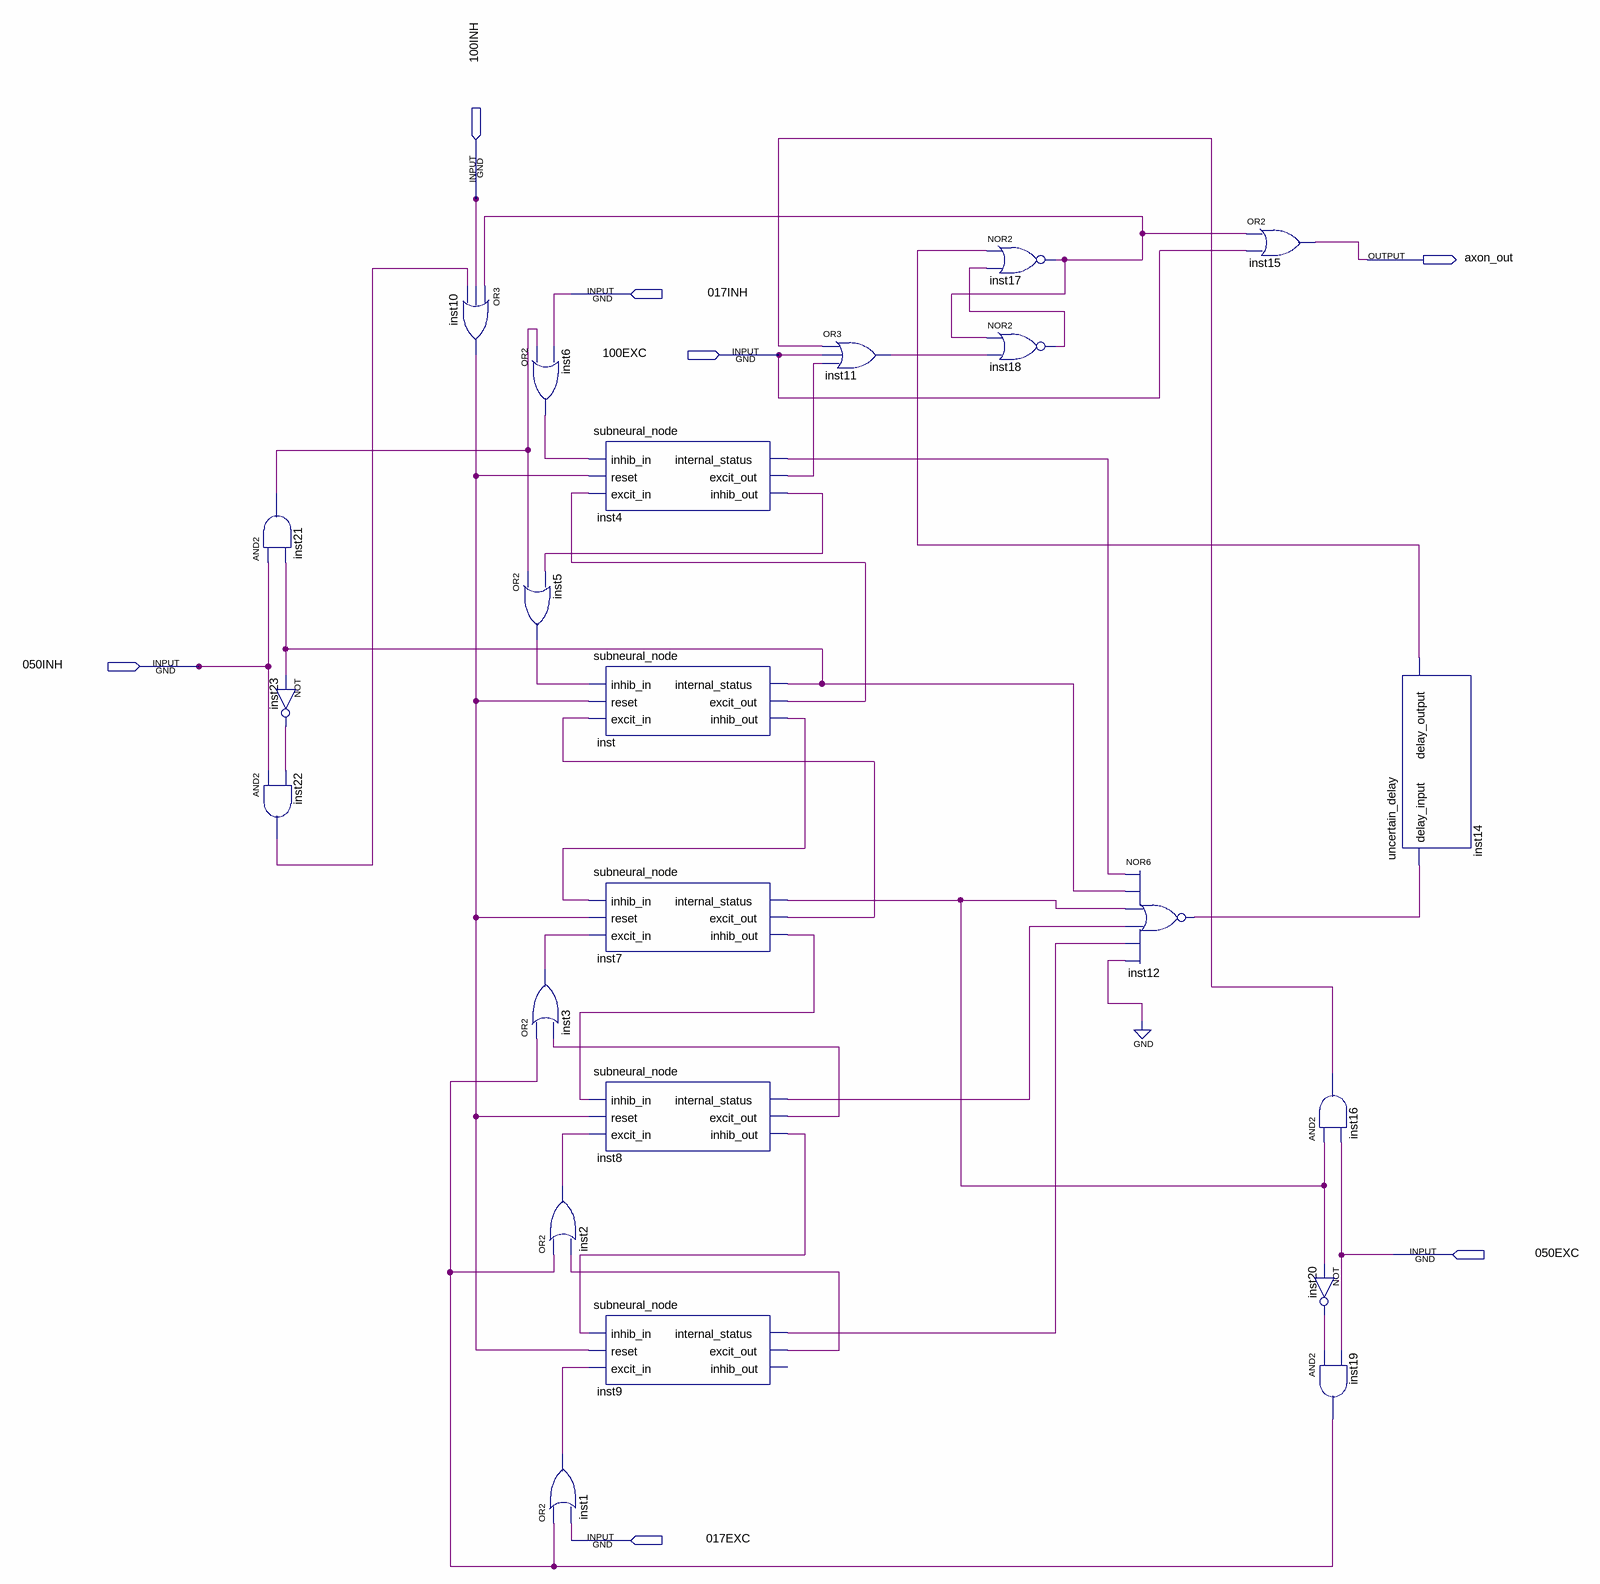
[diagram p0: schematic sheet]
// Quartus schematic soma_control_bloc.bdf as structural Verilog: 23 symbols, 7 pins
module soma_control_bloc (
  input  \100INH ,
  input  \017INH ,
  input  \100EXC ,
  input  \050INH ,
  input  \050EXC ,
  input  \017EXC ,
  output axon_out
);

  wire inst1_out, inst2_out, inst3_out, inst4_excit_out, inst4_inhib_out, inst4_internal_status, inst5_out,
       inst6_out, inst7_excit_out, inst7_inhib_out, inst7_internal_status, inst8_excit_out, inst8_inhib_out,
       inst8_internal_status, inst9_excit_out, inst9_internal_status, inst10_out, inst11_out, inst12_out,
       inst14_delay_output, inst16_out, inst17_out, inst18_out, inst19_out, inst20_out, inst21_out,
       inst22_out, inst23_out, inst_excit_out, inst_inhib_out, inst_internal_status;

  and inst21 (inst21_out, \050INH , inst_internal_status);
  and inst22 (inst22_out, \050INH , inst23_out);
  not inst23 (inst23_out, inst_internal_status);
  or inst10 (inst10_out, inst17_out, \100INH , inst22_out);
  or inst6 (inst6_out, inst21_out, \017INH );
  or inst5 (inst5_out, inst21_out, inst4_inhib_out);
  or inst3 (inst3_out, inst19_out, inst8_excit_out);
  subneural_node inst4 (
    .inhib_in(inst6_out), .reset(inst10_out), .excit_in(inst_excit_out),
    .internal_status(inst4_internal_status), .excit_out(inst4_excit_out), .inhib_out(inst4_inhib_out));
  subneural_node inst (
    .inhib_in(inst5_out), .reset(inst10_out), .excit_in(inst7_excit_out),
    .internal_status(inst_internal_status), .excit_out(inst_excit_out), .inhib_out(inst_inhib_out));
  subneural_node inst7 (
    .inhib_in(inst_inhib_out), .reset(inst10_out), .excit_in(inst3_out),
    .internal_status(inst7_internal_status), .excit_out(inst7_excit_out), .inhib_out(inst7_inhib_out));
  subneural_node inst8 (
    .inhib_in(inst7_inhib_out), .reset(inst10_out), .excit_in(inst2_out),
    .internal_status(inst8_internal_status), .excit_out(inst8_excit_out), .inhib_out(inst8_inhib_out));
  or inst2 (inst2_out, inst19_out, inst9_excit_out);
  subneural_node inst9 (
    .inhib_in(inst8_inhib_out), .reset(inst10_out), .excit_in(inst1_out),
    .internal_status(inst9_internal_status), .excit_out(inst9_excit_out));  // open: inhib_out
  or inst1 (inst1_out, inst19_out, \017EXC );
  or inst11 (inst11_out, inst16_out, \100EXC , inst4_excit_out);
  nor inst17 (inst17_out, inst14_delay_output, inst18_out);
  nor inst18 (inst18_out, inst17_out, inst11_out);
  nor inst12 (inst12_out, inst4_internal_status, inst_internal_status, inst7_internal_status, inst8_internal_status, inst9_internal_status, 1'b0);
  or inst15 (axon_out, inst17_out, \100EXC );
  and inst16 (inst16_out, inst7_internal_status, \050EXC );
  not inst20 (inst20_out, inst7_internal_status);
  and inst19 (inst19_out, inst20_out, \050EXC );
  uncertain_delay inst14 (.delay_input(inst12_out), .delay_output(inst14_delay_output));
endmodule
